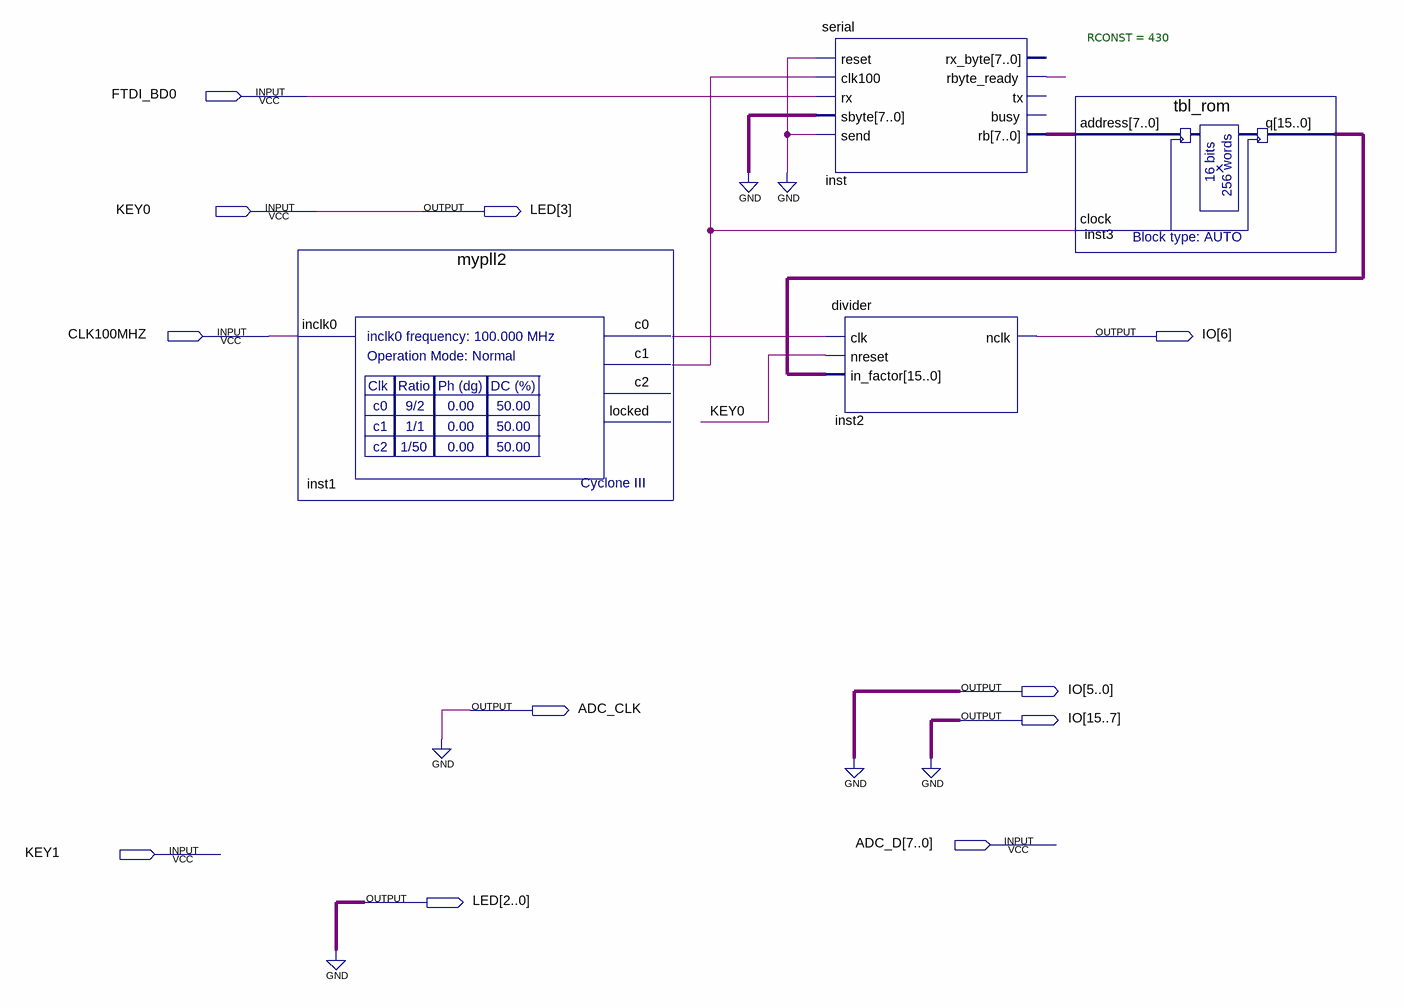
[diagram p0: schematic sheet]
// Quartus schematic cyclone3.bdf as structural Verilog: 4 symbols, 11 pins
module cyclone3 (
  input  FTDI_BD0,
  input  KEY0,
  input  CLK100MHZ,
  input  [7:0] ADC_D,
  input  KEY1,
  output [3:0] LED,
  output [15:0] IO,
  output ADC_CLK
);

  wire inst1_c0, inst1_c1, inst_rbyte_ready;
  wire [7:0] inst_rb;
  wire [15:0] inst3_q;

  mypll2 inst1 (.inclk0(CLK100MHZ), .c0(inst1_c0), .c1(inst1_c1));  // open: c2, locked
  serial #(.RCONST(430)) inst (
    .reset(1'b0), .clk100(inst1_c1), .rx(FTDI_BD0), .sbyte({8{1'b0}}), .send(1'b0),
    .rbyte_ready(inst_rbyte_ready), .rb(inst_rb));  // open: rx_byte, tx, busy
  divider inst2 (.clk(inst1_c0), .nreset(KEY0), .in_factor(inst3_q), .nclk(IO[6]));
  tbl_rom inst3 (.address(inst_rb), .clock(inst1_c1), .q(inst3_q));

  assign ADC_CLK = 1'b0;
  assign {IO[15:7], IO[5:0]} = {15{1'b0}};
  assign LED = {KEY0, 3'b000};
endmodule
